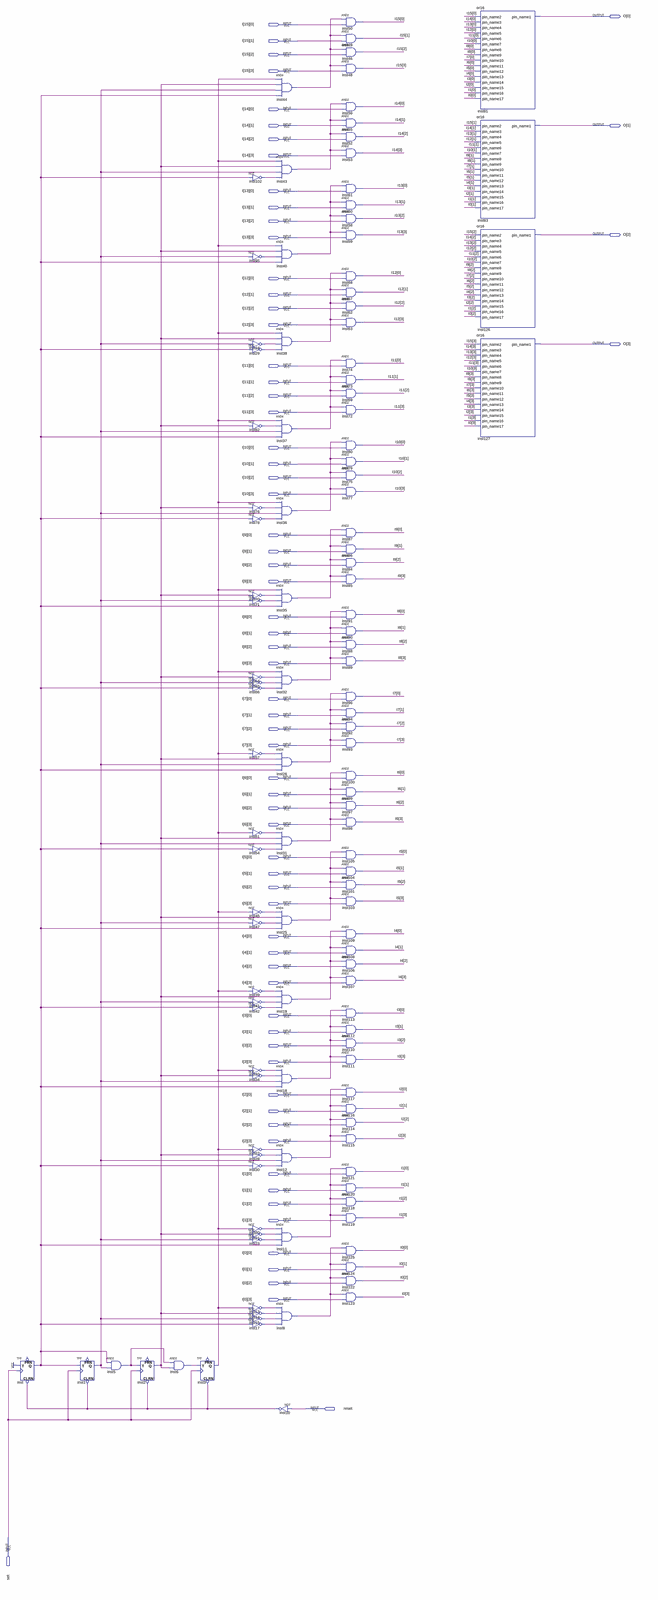
[diagram p0: schematic sheet, whole]
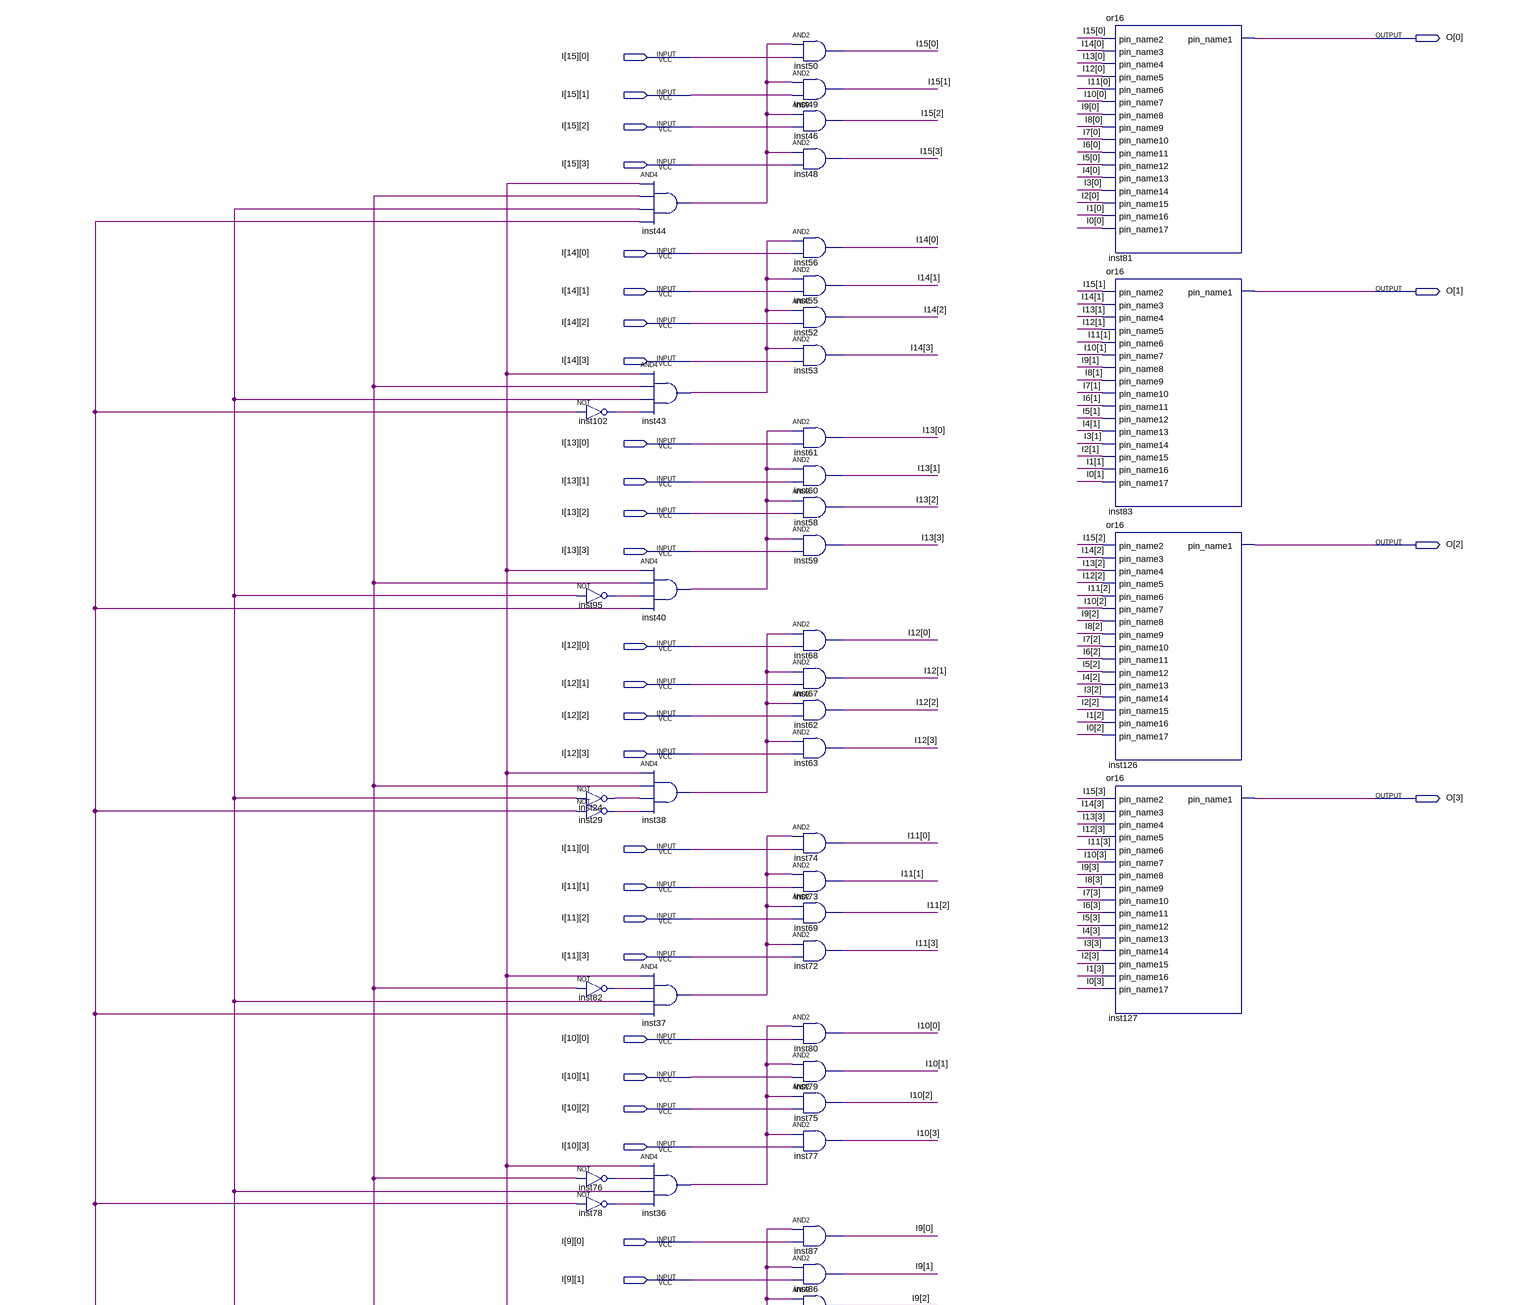
[diagram p1: schematic sheet, upper part]
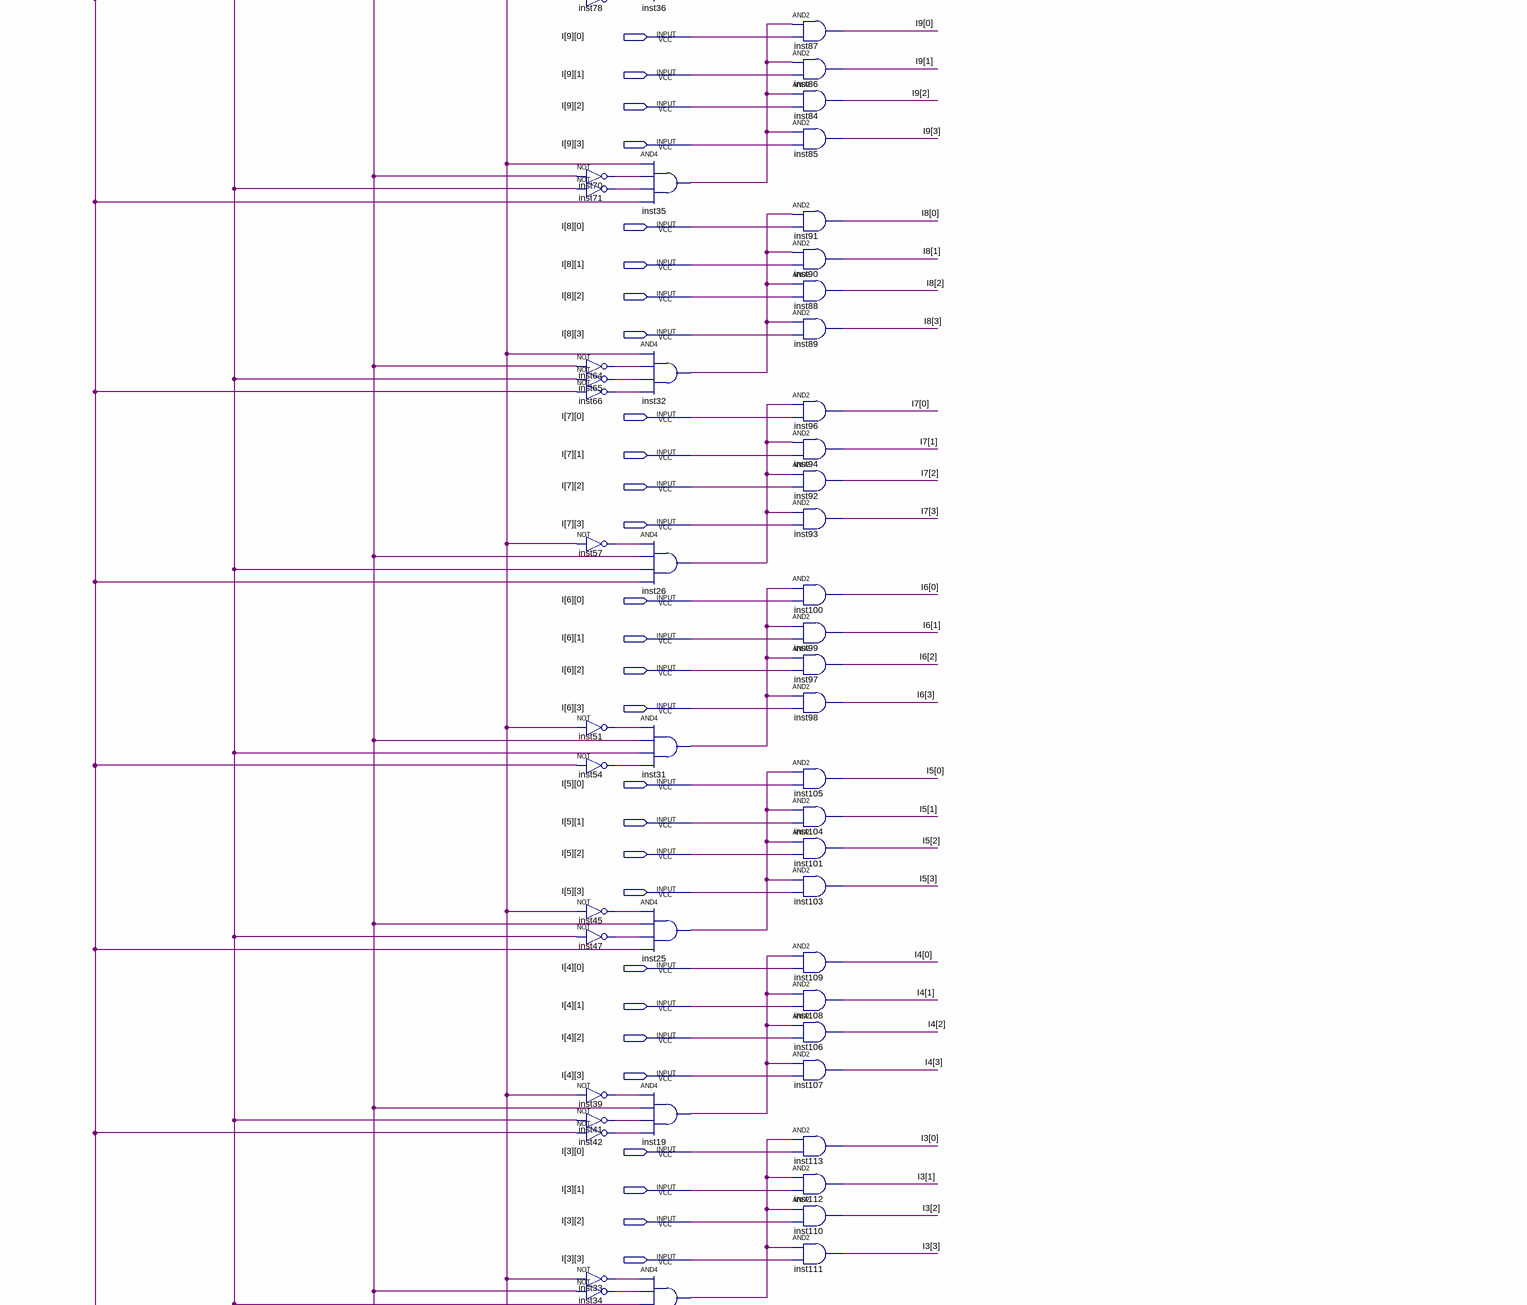
[diagram p2: schematic sheet, middle part]
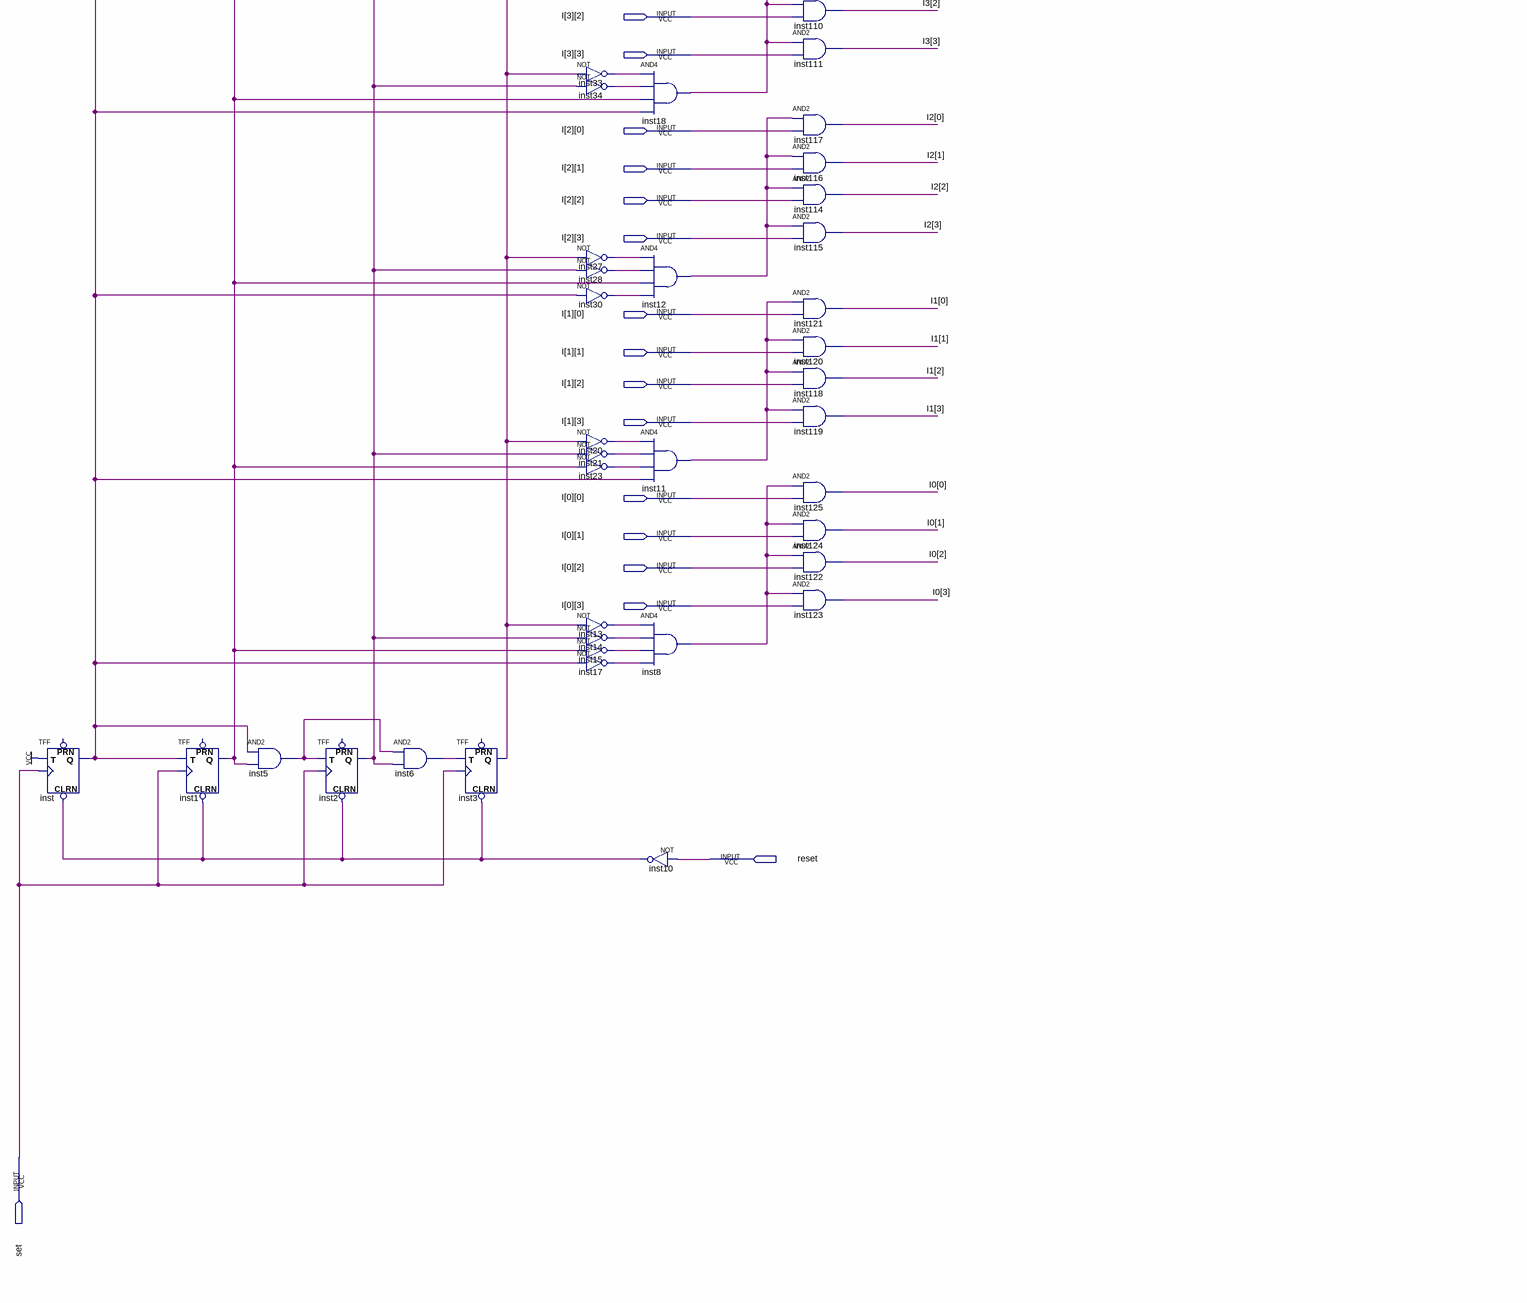
[diagram p3: schematic sheet, lower part]
// Quartus schematic seletor.bdf as structural Verilog: 123 symbols, 70 pins
module seletor (
  input  [3:0] I_15,
  input  [3:0] I_14,
  input  [3:0] I_13,
  input  [3:0] I_12,
  input  [3:0] I_11,
  input  [3:0] I_10,
  input  [3:0] I_9,
  input  [3:0] I_8,
  input  [3:0] I_7,
  input  [3:0] I_6,
  input  [3:0] I_5,
  input  [3:0] I_4,
  input  [3:0] I_3,
  input  [3:0] I_2,
  input  [3:0] I_1,
  input  [3:0] I_0,
  input  reset,
  input  set,
  output [3:0] O
);

  wire inst1_q, inst2_q, inst3_q, inst5_out, inst6_out, inst8_out, inst10_out, inst11_out, inst12_out,
       inst13_out, inst14_out, inst15_out, inst17_out, inst18_out, inst19_out, inst20_out, inst21_out,
       inst23_out, inst24_out, inst25_out, inst26_out, inst27_out, inst28_out, inst29_out, inst30_out,
       inst31_out, inst32_out, inst33_out, inst34_out, inst35_out, inst36_out, inst37_out, inst38_out,
       inst39_out, inst40_out, inst41_out, inst42_out, inst43_out, inst44_out, inst45_out, inst47_out,
       inst51_out, inst54_out, inst57_out, inst64_out, inst65_out, inst66_out, inst70_out, inst71_out,
       inst76_out, inst78_out, inst82_out, inst95_out, inst102_out, inst_q;
  wire [3:0] I0, I1, I2, I3, I4, I5, I6, I7, I8, I9, I10, I11, I12, I13, I14, I15;

  TFF inst (.CLRN(inst10_out), .T(1'b1), .CLK(set), .Q(inst_q));  // open: PRN
  TFF inst1 (.CLRN(inst10_out), .T(inst_q), .CLK(set), .Q(inst1_q));  // open: PRN
  and inst5 (inst5_out, inst_q, inst1_q);
  TFF inst2 (.CLRN(inst10_out), .T(inst5_out), .CLK(set), .Q(inst2_q));  // open: PRN
  and inst6 (inst6_out, inst5_out, inst2_q);
  TFF inst3 (.CLRN(inst10_out), .T(inst6_out), .CLK(set), .Q(inst3_q));  // open: PRN
  not inst102 (inst102_out, inst_q);
  not inst95 (inst95_out, inst1_q);
  not inst24 (inst24_out, inst1_q);
  not inst29 (inst29_out, inst_q);
  not inst82 (inst82_out, inst2_q);
  not inst76 (inst76_out, inst2_q);
  not inst78 (inst78_out, inst_q);
  not inst70 (inst70_out, inst2_q);
  not inst71 (inst71_out, inst1_q);
  not inst64 (inst64_out, inst2_q);
  not inst65 (inst65_out, inst1_q);
  not inst66 (inst66_out, inst_q);
  not inst57 (inst57_out, inst3_q);
  not inst51 (inst51_out, inst3_q);
  not inst54 (inst54_out, inst_q);
  not inst45 (inst45_out, inst3_q);
  not inst47 (inst47_out, inst1_q);
  not inst39 (inst39_out, inst3_q);
  not inst41 (inst41_out, inst1_q);
  not inst42 (inst42_out, inst_q);
  not inst33 (inst33_out, inst3_q);
  not inst34 (inst34_out, inst2_q);
  not inst27 (inst27_out, inst3_q);
  not inst28 (inst28_out, inst2_q);
  not inst30 (inst30_out, inst_q);
  not inst20 (inst20_out, inst3_q);
  not inst21 (inst21_out, inst2_q);
  not inst23 (inst23_out, inst1_q);
  not inst13 (inst13_out, inst3_q);
  not inst14 (inst14_out, inst2_q);
  not inst15 (inst15_out, inst1_q);
  not inst17 (inst17_out, inst_q);
  and inst44 (inst44_out, inst3_q, inst2_q, inst1_q, inst_q);
  and inst43 (inst43_out, inst3_q, inst2_q, inst1_q, inst102_out);
  and inst40 (inst40_out, inst3_q, inst2_q, inst95_out, inst_q);
  and inst38 (inst38_out, inst3_q, inst2_q, inst24_out, inst29_out);
  and inst37 (inst37_out, inst3_q, inst82_out, inst1_q, inst_q);
  and inst36 (inst36_out, inst3_q, inst76_out, inst1_q, inst78_out);
  and inst35 (inst35_out, inst3_q, inst70_out, inst71_out, inst_q);
  and inst32 (inst32_out, inst3_q, inst64_out, inst65_out, inst66_out);
  and inst26 (inst26_out, inst57_out, inst2_q, inst1_q, inst_q);
  and inst31 (inst31_out, inst51_out, inst2_q, inst1_q, inst54_out);
  and inst25 (inst25_out, inst45_out, inst2_q, inst47_out, inst_q);
  and inst19 (inst19_out, inst39_out, inst2_q, inst41_out, inst42_out);
  and inst18 (inst18_out, inst33_out, inst34_out, inst1_q, inst_q);
  and inst12 (inst12_out, inst27_out, inst28_out, inst1_q, inst30_out);
  and inst11 (inst11_out, inst20_out, inst21_out, inst23_out, inst_q);
  and inst8 (inst8_out, inst13_out, inst14_out, inst15_out, inst17_out);
  not inst10 (inst10_out, reset);
  and inst50 (I15[0], inst44_out, I_15[0]);
  and inst49 (I15[1], inst44_out, I_15[1]);
  and inst46 (I15[2], inst44_out, I_15[2]);
  and inst48 (I15[3], inst44_out, I_15[3]);
  and inst56 (I14[0], inst43_out, I_14[0]);
  and inst55 (I14[1], inst43_out, I_14[1]);
  and inst52 (I14[2], inst43_out, I_14[2]);
  and inst53 (I14[3], inst43_out, I_14[3]);
  and inst61 (I13[0], inst40_out, I_13[0]);
  and inst60 (I13[1], inst40_out, I_13[1]);
  and inst58 (I13[2], inst40_out, I_13[2]);
  and inst59 (I13[3], inst40_out, I_13[3]);
  and inst68 (I12[0], inst38_out, I_12[0]);
  and inst67 (I12[1], inst38_out, I_12[1]);
  and inst62 (I12[2], inst38_out, I_12[2]);
  and inst63 (I12[3], inst38_out, I_12[3]);
  and inst74 (I11[0], inst37_out, I_11[0]);
  and inst73 (I11[1], inst37_out, I_11[1]);
  and inst69 (I11[2], inst37_out, I_11[2]);
  and inst72 (I11[3], inst37_out, I_11[3]);
  and inst80 (I10[0], inst36_out, I_10[0]);
  and inst79 (I10[1], inst36_out, I_10[1]);
  and inst75 (I10[2], inst36_out, I_10[2]);
  and inst77 (I10[3], inst36_out, I_10[3]);
  and inst87 (I9[0], inst35_out, I_9[0]);
  and inst86 (I9[1], inst35_out, I_9[1]);
  and inst84 (I9[2], inst35_out, I_9[2]);
  and inst85 (I9[3], inst35_out, I_9[3]);
  and inst91 (I8[0], inst32_out, I_8[0]);
  and inst90 (I8[1], inst32_out, I_8[1]);
  and inst88 (I8[2], inst32_out, I_8[2]);
  and inst89 (I8[3], inst32_out, I_8[3]);
  and inst96 (I7[0], inst26_out, I_7[0]);
  and inst94 (I7[1], inst26_out, I_7[1]);
  and inst92 (I7[2], inst26_out, I_7[2]);
  and inst93 (I7[3], inst26_out, I_7[3]);
  and inst100 (I6[0], inst31_out, I_6[0]);
  and inst99 (I6[1], inst31_out, I_6[1]);
  and inst97 (I6[2], inst31_out, I_6[2]);
  and inst98 (I6[3], inst31_out, I_6[3]);
  and inst105 (I5[0], inst25_out, I_5[0]);
  and inst104 (I5[1], inst25_out, I_5[1]);
  and inst101 (I5[2], inst25_out, I_5[2]);
  and inst103 (I5[3], inst25_out, I_5[3]);
  and inst109 (I4[0], inst19_out, I_4[0]);
  and inst108 (I4[1], inst19_out, I_4[1]);
  and inst106 (I4[2], inst19_out, I_4[2]);
  and inst107 (I4[3], inst19_out, I_4[3]);
  and inst113 (I3[0], inst18_out, I_3[0]);
  and inst112 (I3[1], inst18_out, I_3[1]);
  and inst110 (I3[2], inst18_out, I_3[2]);
  and inst111 (I3[3], inst18_out, I_3[3]);
  and inst117 (I2[0], inst12_out, I_2[0]);
  and inst116 (I2[1], inst12_out, I_2[1]);
  and inst114 (I2[2], inst12_out, I_2[2]);
  and inst115 (I2[3], inst12_out, I_2[3]);
  and inst121 (I1[0], inst11_out, I_1[0]);
  and inst120 (I1[1], inst11_out, I_1[1]);
  and inst118 (I1[2], inst11_out, I_1[2]);
  and inst119 (I1[3], inst11_out, I_1[3]);
  and inst125 (I0[0], inst8_out, I_0[0]);
  and inst124 (I0[1], inst8_out, I_0[1]);
  and inst122 (I0[2], inst8_out, I_0[2]);
  and inst123 (I0[3], inst8_out, I_0[3]);
  or16 inst81 (
    .pin_name2(I15[0]), .pin_name3(I14[0]), .pin_name4(I13[0]), .pin_name5(I12[0]), .pin_name6(I11[0]),
    .pin_name7(I10[0]), .pin_name8(I9[0]), .pin_name9(I8[0]), .pin_name10(I7[0]), .pin_name11(I6[0]),
    .pin_name12(I5[0]), .pin_name13(I4[0]), .pin_name14(I3[0]), .pin_name15(I2[0]), .pin_name16(I1[0]),
    .pin_name17(I0[0]), .pin_name1(O[0]));
  or16 inst83 (
    .pin_name2(I15[1]), .pin_name3(I14[1]), .pin_name4(I13[1]), .pin_name5(I12[1]), .pin_name6(I11[1]),
    .pin_name7(I10[1]), .pin_name8(I9[1]), .pin_name9(I8[1]), .pin_name10(I7[1]), .pin_name11(I6[1]),
    .pin_name12(I5[1]), .pin_name13(I4[1]), .pin_name14(I3[1]), .pin_name15(I2[1]), .pin_name16(I1[1]),
    .pin_name17(I0[1]), .pin_name1(O[1]));
  or16 inst126 (
    .pin_name2(I15[2]), .pin_name3(I14[2]), .pin_name4(I13[2]), .pin_name5(I12[2]), .pin_name6(I11[2]),
    .pin_name7(I10[2]), .pin_name8(I9[2]), .pin_name9(I8[2]), .pin_name10(I7[2]), .pin_name11(I6[2]),
    .pin_name12(I5[2]), .pin_name13(I4[2]), .pin_name14(I3[2]), .pin_name15(I2[2]), .pin_name16(I1[2]),
    .pin_name17(I0[2]), .pin_name1(O[2]));
  or16 inst127 (
    .pin_name2(I15[3]), .pin_name3(I14[3]), .pin_name4(I13[3]), .pin_name5(I12[3]), .pin_name6(I11[3]),
    .pin_name7(I10[3]), .pin_name8(I9[3]), .pin_name9(I8[3]), .pin_name10(I7[3]), .pin_name11(I6[3]),
    .pin_name12(I5[3]), .pin_name13(I4[3]), .pin_name14(I3[3]), .pin_name15(I2[3]), .pin_name16(I1[3]),
    .pin_name17(I0[3]), .pin_name1(O[3]));
endmodule
